# EAGLE design s3-pilot2 (EAGLE 7.2.0)
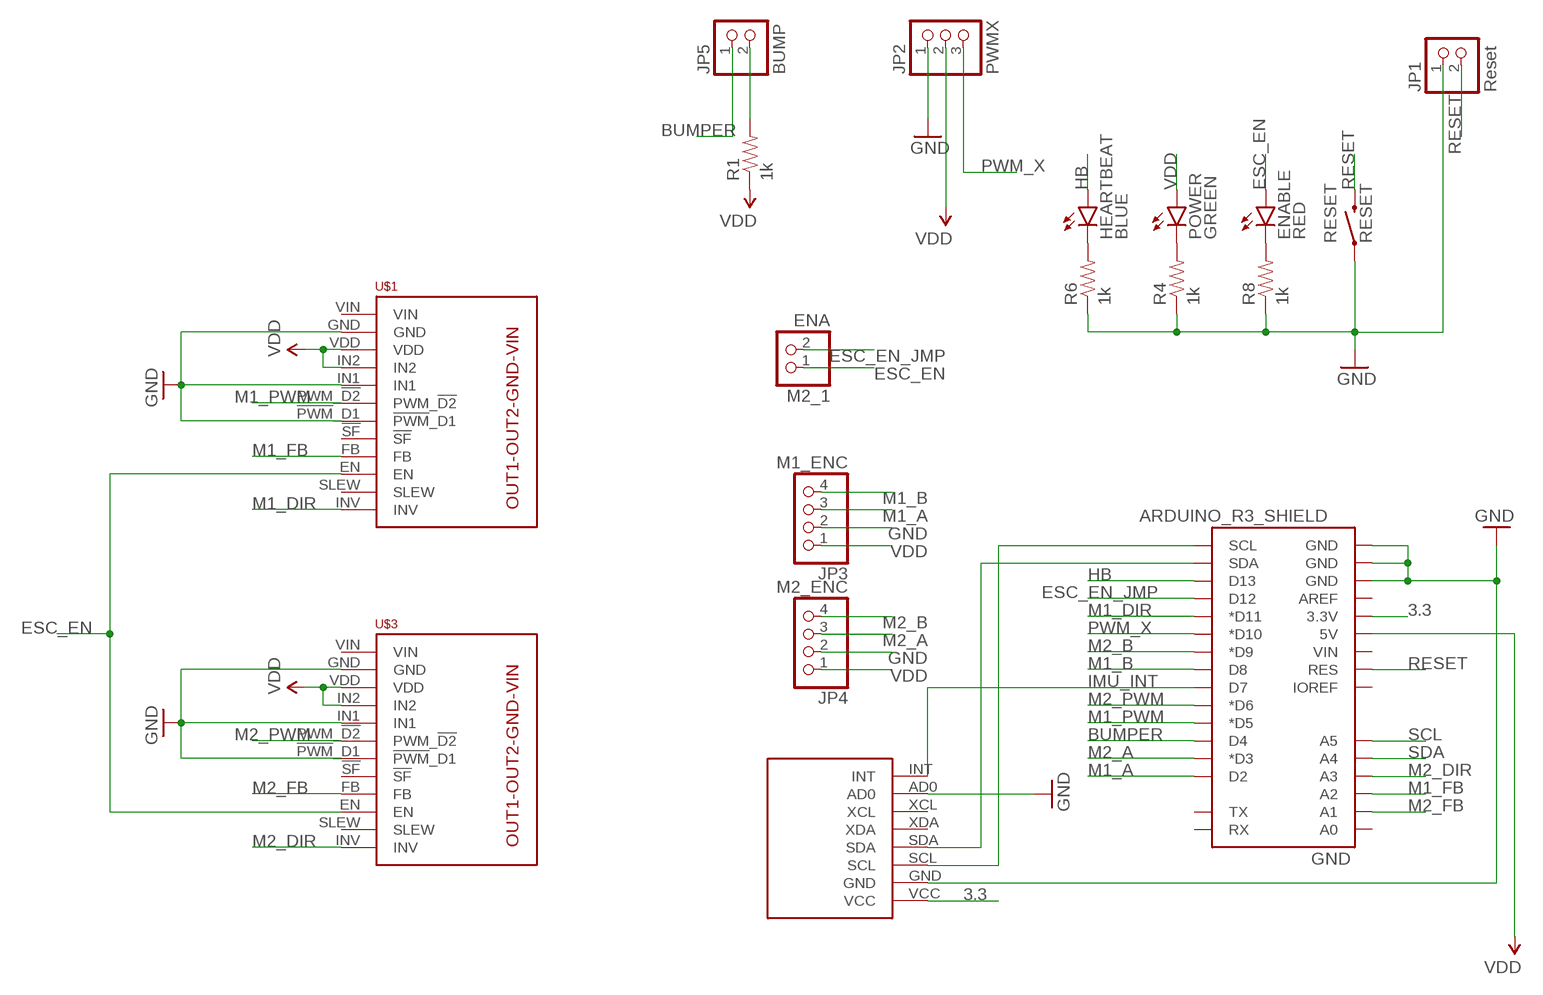
[diagram p0: schematic, sheet 1]

## Parts
ENABLE  RED  LED-RED1206  [LED-1206]
GND  ARDUINO_R3_SHIELD  [UNO_R3_SHIELD]
HEARTBEAT  BLUE  LED-BLUE1206  [LED-1206]
JP1  Reset  PINHD-1X2  [1X02]
JP2  PWMX  PINHD-1X3/90  [1X03/90]
JP3  M1_ENC  PINHD-1X4/90  [1X04/90]
JP4  M2_ENC  PINHD-1X4/90  [1X04/90]
JP5  BUMP  PINHD-1X2/90  [1X02/90]
M2_1  ENA  PINHD-1X2  [1X02]
MPU6050  MPU-6050-BO  [MPU-6050-BO]
POWER  GREEN  LED-GREENLARGE  [LED-1206]
R1  1k  RESISTOR1206  [1206]
R4  1k  RESISTOR1206  [1206]
R6  1k  RESISTOR1206  [1206]
R8  1k  RESISTOR1206  [1206]
RESET  RESET  SWITCH-MOMENTARY-2SMD-4  [TACTILE_SWITCH_TALL]
U$1  M1  MC33926-SINGLE-BO  [MC33926-SINGLE-BO]
U$3  M2  MC33926-SINGLE-BO  [MC33926-SINGLE-BO]

## Nets
3.3: GND.3.3V MPU6050.VCC
BUMPER: GND.D4 JP5.1
ESC_EN: ENABLE.A M2_1.1 U$1.EN U$3.EN
ESC_EN_JMP: GND.D12 M2_1.2
GND [Supply]: GND.GND@0(GND) GND.GND@1(GND) GND.GND@2(GND) JP1.1 JP2.1 JP3.2 JP4.2 MPU6050.AD0 MPU6050.GND R4.1 R6.1 R8.1 RESET.A2 U$1.!PWM!_D1 U$1.GND U$1.IN1 U$3.!PWM!_D1 U$3.GND U$3.IN1
HB: GND.D13 HEARTBEAT.A
IMU_INT: GND.D7 MPU6050.INT
M1_A: GND.D2 JP3.3
M1_B: GND.D8 JP3.4
M1_DIR: GND.D11(*D11) U$1.INV
M1_FB: GND.A2 U$1.FB
M1_PWM: GND.D5(*D5) U$1.PWM_!D2
M2_A: GND.D3(*D3) JP4.3
M2_B: GND.D9(*D9) JP4.4
M2_DIR: GND.A3 U$3.INV
M2_FB: GND.A1 U$3.FB
M2_PWM: GND.D6(*D6) U$3.PWM_!D2
N$3: JP5.2 R1.2
N$21: POWER.C R4.2
N$23: ENABLE.C R8.2
N$24: HEARTBEAT.C R6.2
PWM_X: GND.D10(*D10) JP2.3
RESET: GND.RES JP1.2 RESET.B2
SCL: GND.A5 GND.SCL MPU6050.SCL
SDA: GND.A4 GND.SDA MPU6050.SDA
VDD [Supply]: GND.5V JP2.2 JP3.1 JP4.1 POWER.A R1.1 U$1.IN2 U$1.VDD U$3.IN2 U$3.VDD
Unconnected: GND.A0 GND.AREF GND.IOREF GND.RX GND.TX GND.VIN MPU6050.XCL MPU6050.XDA U$1.!SF U$1.SLEW U$1.VIN U$3.!SF U$3.SLEW U$3.VIN

## Library data of the parts
ENABLE = SparkFun-LED:LED-RED: Assorted Red LEDs LilyPad 1206- DIO-09912 1206- DIO-00809 0603- DIO-00819; PROD_ID: DIO-00809
GND = SparkFun-Boards:ARDUINO_R3_SHIELD: Shield form compatible with the Arduino Uno R3.
HEARTBEAT = SparkFun-LED:LED-BLUE: Blue LEDs for production use Various blue LEDs stocked by SparkFun production 0603 - DIO-08575 Rebel - DIO-09553 1206 - DIO-09911; PROD_ID: DIO-09911
JP1 JP5 M2_1 = pinhead:PINHD-1X2: PIN HEADER
JP2 = pinhead:PINHD-1X3: PIN HEADER
JP3 JP4 = pinhead:PINHD-1X4: PIN HEADER
MPU6050 = s3-pilot2-lbr:MPU-6050-BO
POWER = SparkFun-LED:LED-GREEN: Various green LEDs Green LEDs used in SFE Production 0603- DIO-00821 LARGE- DIO-00862 LILYPAD- DIO-09910; PROD_ID: DIO-00862
R1 R4 R6 R8 = SparkFun-Passives:RESISTOR: Resistor Basic schematic elements and footprints for 0603, 1206, and PTH resistors.
RESET = SparkFun-Electromechanical:SWITCH-MOMENTARY-2: Various NO switches- pushbuttons, reed, etc; PROD_ID: SWCH-11966
U$1 U$3 = s3-pilot2-lbr:MC33926-SINGLE-BO

## Net classes
1 Supply: width 0.508 mm

## Board
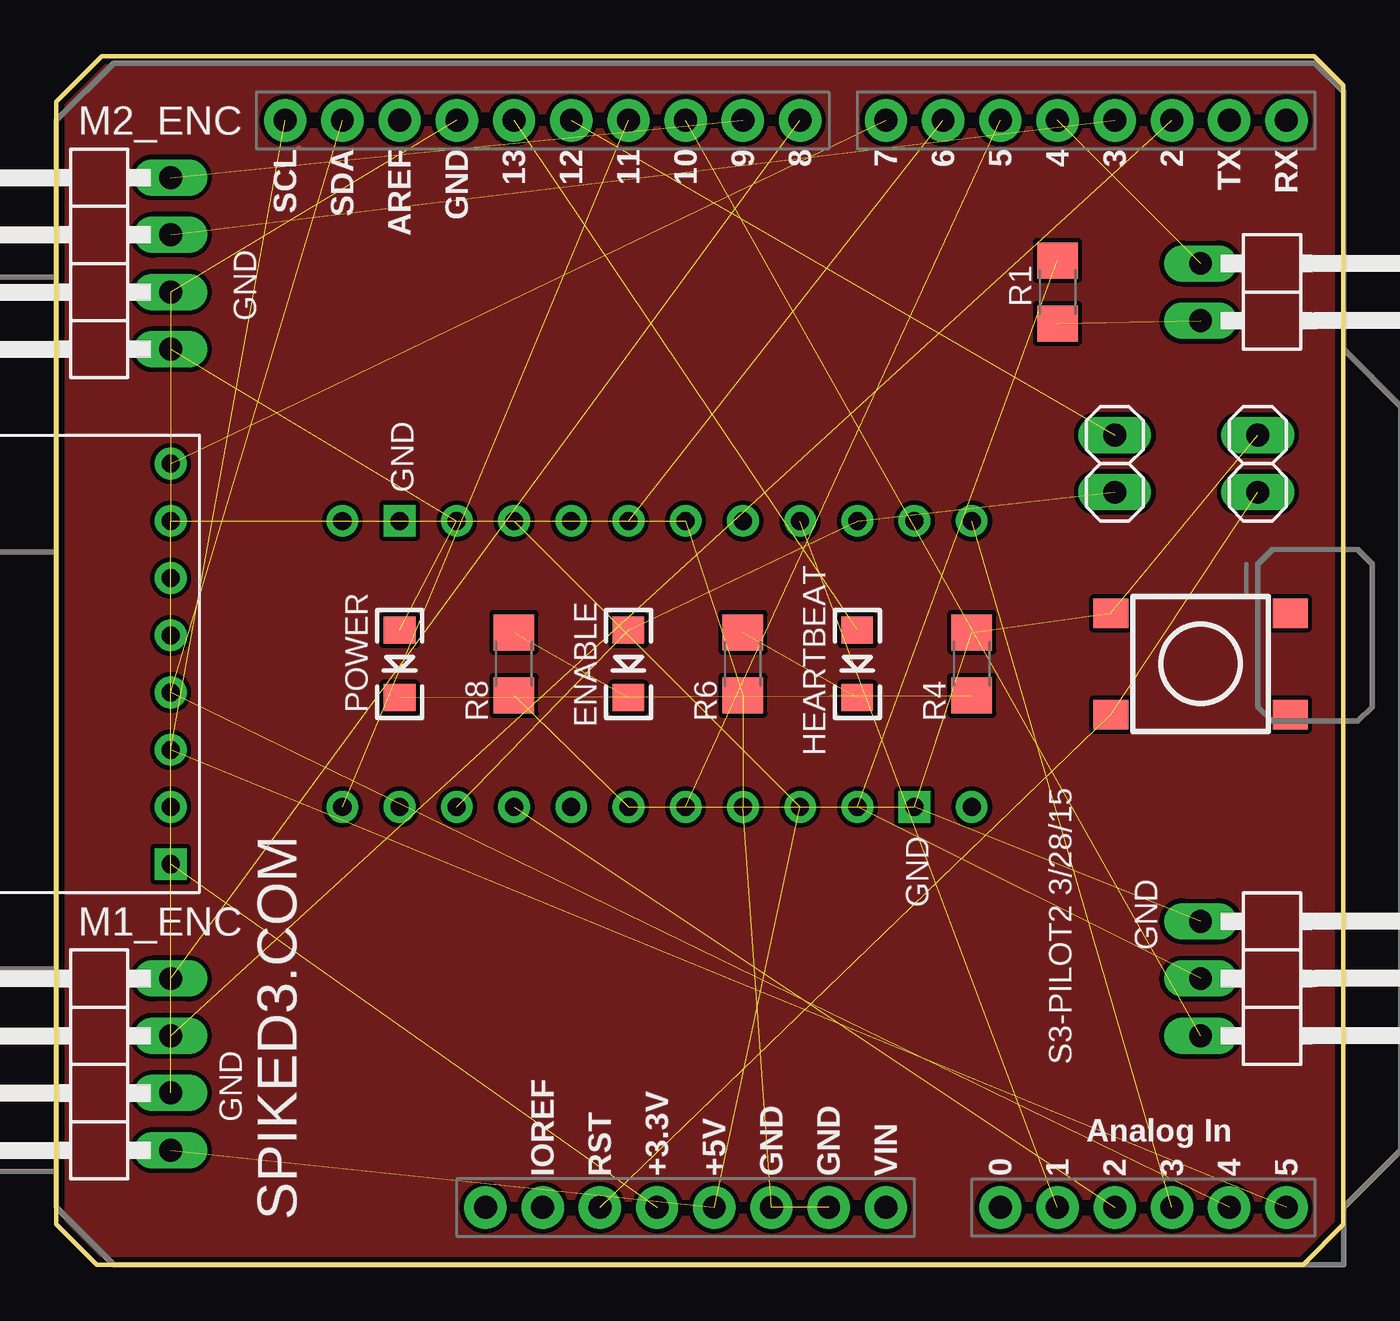
[diagram p1: board, top side]
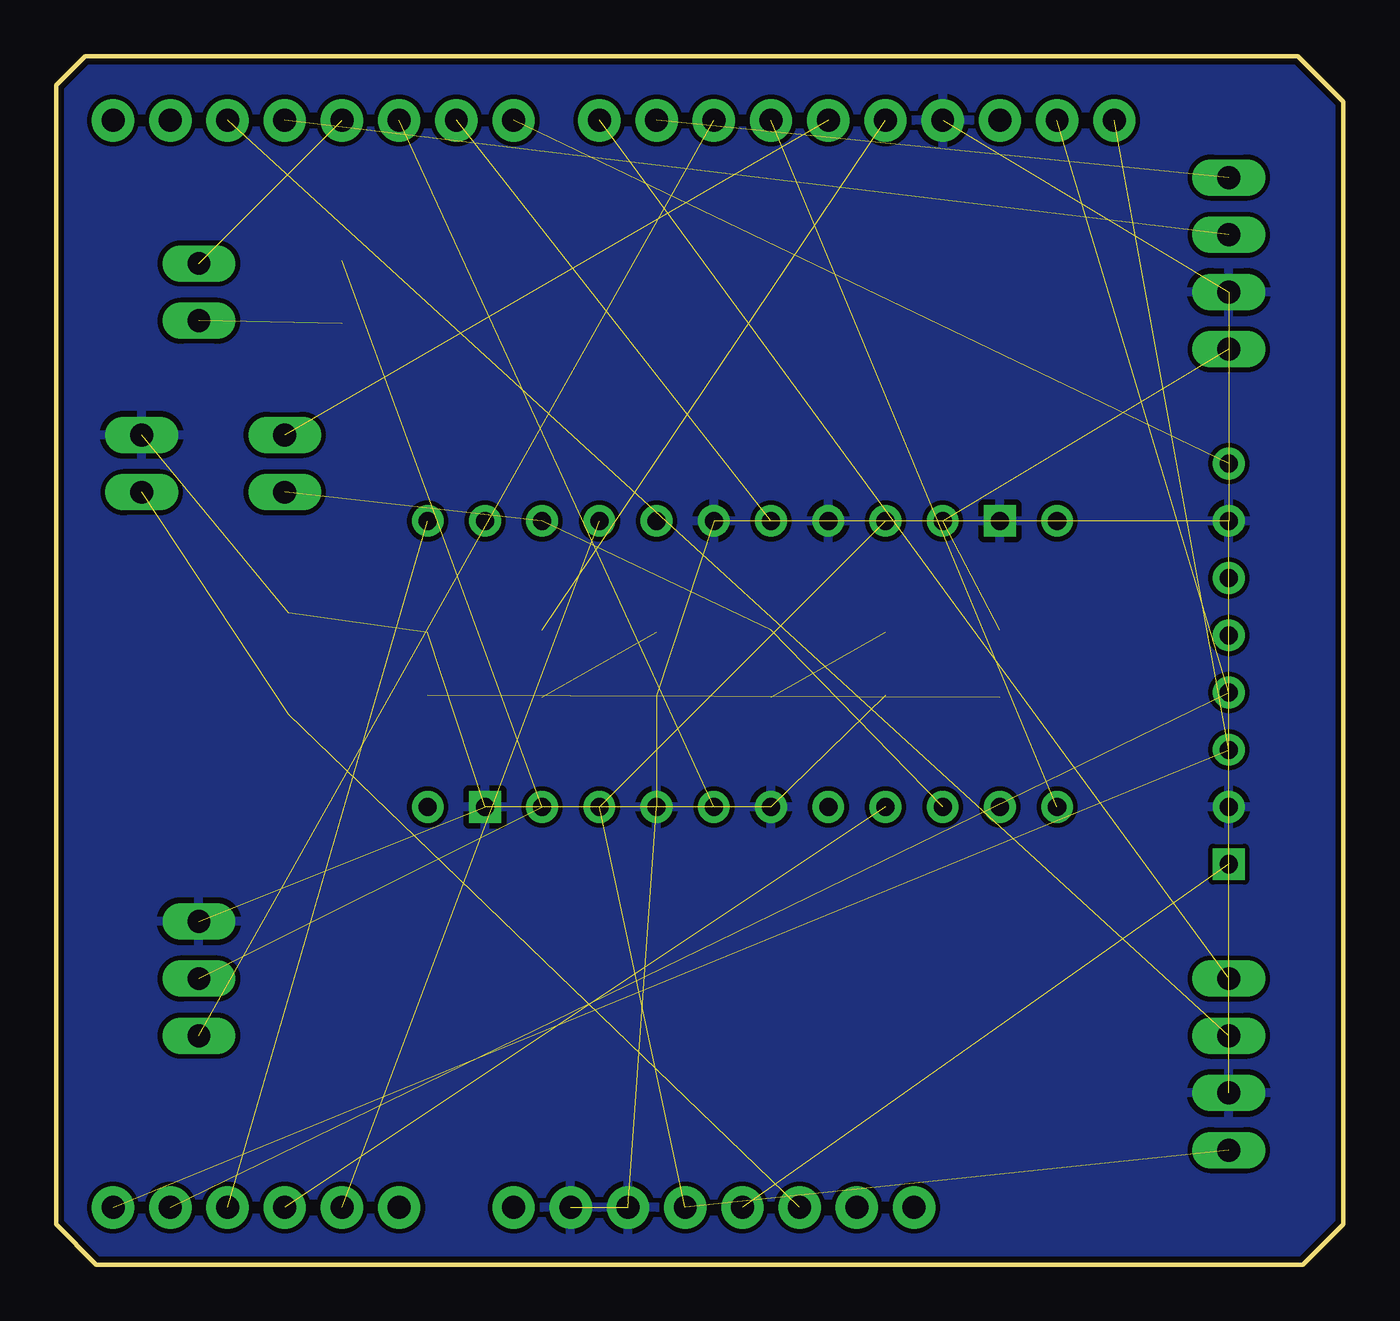
[diagram p2: board, bottom side, seen from below]

Size 57.13 x 53.65 mm. Coordinates in mm from the lower left corner, seen from the top.
Outline: 0,51.62 0,1.8 1.8,0 55.35,0 57.13,1.78 57.13,52.36 55.84,53.65 2.02,53.65 0,51.62
Copper layers (1*16): Top 0.035mm / dielectric 1.5mm / Bottom 0.035mm
Design rules "SparkFun": minimum track width 8mil, minimum drill 20mil, track to track 8mil, track to pad 8mil, pad to pad 8mil, via to via 8mil, smd to smd 8mil, copper to edge 10mil, drill to drill 8mil, minimum pad ring 12mil, minimum via ring 10mil, stop-mask expansion 4mil, vias tented up to drill 25mil, thermal gap 10mil

### Footprints (pad centres in the part's own frame; a part is rotated, then mirrored left to right if it is on the bottom)
LED-1206 = smd 1.2 x 1.4: A -1.5,0; C 1.5,0
UNO_R3_SHIELD = drill 1.016 pad 1.88: 3.3V 50.8,26.67; 5V 50.8,29.21; A0 50.8,41.91; A1 50.8,44.45; A2 50.8,46.99; A3 50.8,49.53; A4 50.8,52.07; A5 50.8,54.61; AREF 2.54,15.24; D2 2.54,49.53; D3 2.54,46.99; D4 2.54,44.45; D5 2.54,41.91; D6 2.54,39.37; D7 2.54,36.83; D8 2.54,33.02; D9 2.54,30.48; D10 2.54,27.94; D11 2.54,25.4; D12 2.54,22.86; D13 2.54,20.32; GND@0 50.8,31.75; GND@1 50.8,34.29; GND@2 2.54,17.78; IOREF 50.8,21.59; NC 50.8,19.05; RES 50.8,24.13; RX 2.54,54.61; SCL 2.54,10.16; SDA 2.54,12.7; TX 2.54,52.07; VIN 50.8,36.83
1X02 = drill 1.016 long: 1 -1.27,0; 2 1.27,0
1X03/90 = drill 1.016 long: 1 -2.54,-3.81; 2 0,-3.81; 3 2.54,-3.81
1X04/90 = drill 1.016 long: 1 -3.81,-3.81; 2 -1.27,-3.81; 3 1.27,-3.81; 4 3.81,-3.81
1X02/90 = drill 1.016 long: 1 -1.27,-3.81; 2 1.27,-3.81
MPU-6050-BO = drill 0.8: AD0 1.27,3.81; GND 1.27,16.51; INT 1.27,1.27; SCL 1.27,13.97; SDA 1.27,11.43; XCL 1.27,6.35; XDA 1.27,8.89 | drill 0.8 square: VCC 1.27,19.05
1206 = smd 1.6 x 1.8: 1 -1.4,0; 2 1.4,0
TACTILE_SWITCH_TALL = smd 1.55 x 1.3: A1 -3.975,-2.25; A2 3.975,-2.25; B1 -3.975,2.25; B2 3.975,2.25
MC33926-SINGLE-BO = drill 0.8: !PWM!_D1 -5.08,-8.89; !SF -5.08,-11.43; EN -5.08,-16.51; FB -5.08,-13.97; IN1 -5.08,-3.81; IN2 -5.08,-1.27; INV -5.08,-21.59; PWM_!D2 -5.08,-6.35; SLEW -5.08,-19.05; VDD -5.08,1.27; VIN -5.08,6.35 | drill 0.8 square: GND -5.08,3.81

### Placement (x,y rotation side)
ENABLE  25.4,26.67 270 top
GND  0,53.34 270 top
HEARTBEAT  35.56,26.67 270 top
JP1  53.34,35.56 270 top
JP2  54.61,12.7 270 top
JP3  1.27,8.89 90 top
JP4  1.27,44.45 90 top
JP5  54.61,43.18 270 top
M2_1  46.99,35.56 90 top
MPU6050  6.35,36.83 180 top
POWER  15.24,26.67 270 top
R1  44.45,43.18 270 top
R4  40.64,26.67 270 top
R6  30.48,26.67 90 top
R8  20.32,26.67 90 top
RESET  50.8,26.67 180 top
U$1  34.29,15.24 270 top
U$3  19.05,38.1 90 top

### Tracks (layer width: path | path; a pad name or v marks a point on that pad's centre or on a via)
3.3  (1 unrouted)
BUMPER  (1 unrouted)
ESC_EN  (3 unrouted)
ESC_EN_JMP  (1 unrouted)
GND  (18 unrouted)
  pour Bottom: 0,53.98 57.15,53.98 57.15,0 0,0
HB  (1 unrouted)
IMU_INT  (1 unrouted)
M1_A  (1 unrouted)
M1_B  (1 unrouted)
M1_DIR  (1 unrouted)
M1_FB  (1 unrouted)
M1_PWM  (1 unrouted)
M2_A  (1 unrouted)
M2_B  (1 unrouted)
M2_DIR  (1 unrouted)
M2_FB  (1 unrouted)
M2_PWM  (1 unrouted)
N$1
  Top 0.203: 10.77,49.58
  pour Top: 0,53.98 57.15,53.98 57.15,0 0,0
N$3  (1 unrouted)
N$21  (1 unrouted)
N$23  (1 unrouted)
N$24  (1 unrouted)
PWM_X  (1 unrouted)
RESET  (2 unrouted)
SCL  (2 unrouted)
SDA  (2 unrouted)
VDD  (9 unrouted)

### Text on the board
tPlace: GND | GND | SPIKED3.COM | GND | GND | S3-PILOT2 3/28/15 | GND